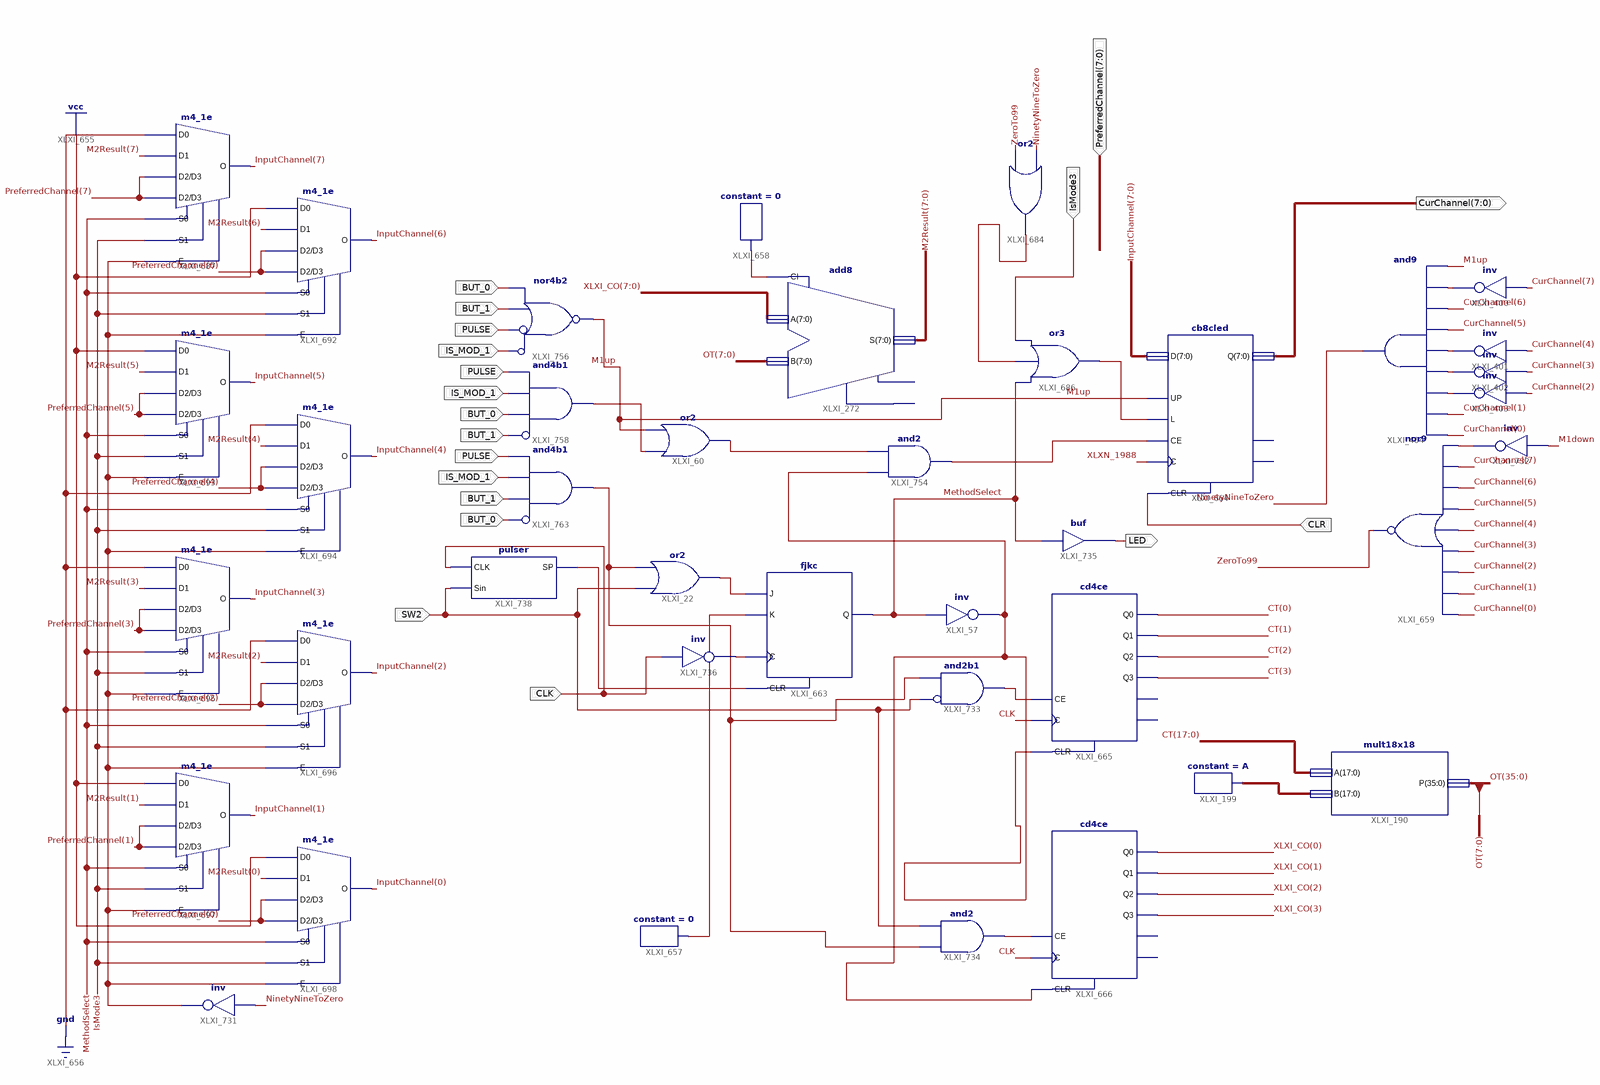
[diagram p0: schematic sheet 1]
// Xilinx ISE schematic mode1.sch (spartan3e) as structural Verilog: 39 symbols, 11 ports
module mode1 (
  input  IsMode3,
  input  CLR,
  input  CLK,
  input  SW2,
  input  BUT_0,
  input  BUT_1,
  input  [7:0] PreferredChannel,
  input  PULSE,
  input  IS_MOD_1,
  output [7:0] CurChannel,
  output LED
);

  wire M1down, M1up, MethodSelect, NinetyNineToZero, XLXN_160, XLXN_169, XLXN_223, XLXN_945, XLXN_1125,
       XLXN_1128, XLXN_1129, XLXN_1130, XLXN_1232, XLXN_1242, XLXN_1730, XLXN_1780, XLXN_1820, XLXN_1826,
       XLXN_1976, XLXN_1978, XLXN_1980, XLXN_1988, XLXN_1991, ZeroTo99;
  wire [7:0] InputChannel, M2Result, XLXI_CO;
  wire [17:0] CT, Ten;
  wire [35:0] OT;

  or XLXI_22 (XLXN_1826, SW2, XLXN_1232);
  or XLXI_60 (XLXN_223, M1down, M1up);
  not XLXI_57 (XLXN_1242, MethodSelect);
  constant #(.CValue("A")) XLXI_199 (.O(Ten));
  mult18x18 XLXI_190 (.A(CT), .B(Ten), .P(OT));
  add8 XLXI_272 (.A(XLXI_CO), .B(OT[7:0]), .CI(XLXN_1730), .S(M2Result));  // open: CO, OFL
  and XLXI_404 (NinetyNineToZero, M1up, XLXN_1125, CurChannel[6], CurChannel[5], XLXN_1128, XLXN_1129, XLXN_1130, CurChannel[1], CurChannel[0]);
  not XLXI_403 (XLXN_1130, CurChannel[2]);
  not XLXI_402 (XLXN_1129, CurChannel[3]);
  not XLXI_401 (XLXN_1128, CurChannel[4]);
  not XLXI_400 (XLXN_1125, CurChannel[7]);
  constant #(.CValue("0")) XLXI_657 (.O(XLXN_1820));
  constant #(.CValue("0")) XLXI_658 (.O(XLXN_1730));
  nor XLXI_659 (ZeroTo99, XLXN_1980, CurChannel[7], CurChannel[6], CurChannel[5], CurChannel[4], CurChannel[3], CurChannel[2], CurChannel[1], CurChannel[0]);
  fjkc XLXI_663 (.C(XLXN_1988), .CLR(XLXN_1991), .J(XLXN_1826), .K(XLXN_1820), .Q(MethodSelect));
  cb8cled XLXI_664 (
    .C(XLXN_1988), .CE(XLXN_945), .CLR(CLR), .D(InputChannel), .L(XLXN_1780), .UP(M1up), .Q(CurChannel));  // open: CEO, TC
  cd4ce XLXI_665 (
    .C(CLK), .CE(XLXN_169), .CLR(XLXN_1242), .Q0(CT[0]), .Q1(CT[1]), .Q2(CT[2]), .Q3(CT[3]));  // open: CEO, TC
  cd4ce XLXI_666 (
    .C(CLK), .CE(XLXN_160), .CLR(XLXN_1242), .Q0(XLXI_CO[0]), .Q1(XLXI_CO[1]), .Q2(XLXI_CO[2]),
    .Q3(XLXI_CO[3]));  // open: CEO, TC
  or XLXI_684 (XLXN_1978, ZeroTo99, NinetyNineToZero);
  or XLXI_686 (XLXN_1780, MethodSelect, XLXN_1978, IsMode3);
  m4_1e XLXI_698 (
    .D0(1'b1), .D1(M2Result[0]), .D2(PreferredChannel[0]), .D3(PreferredChannel[0]), .E(XLXN_1976),
    .S0(MethodSelect), .S1(IsMode3), .O(InputChannel[0]));
  m4_1e XLXI_697 (
    .D0(1'b1), .D1(M2Result[1]), .D2(PreferredChannel[1]), .D3(PreferredChannel[1]), .E(XLXN_1976),
    .S0(MethodSelect), .S1(IsMode3), .O(InputChannel[1]));
  m4_1e XLXI_696 (
    .D0(1'b0), .D1(M2Result[2]), .D2(PreferredChannel[2]), .D3(PreferredChannel[2]), .E(XLXN_1976),
    .S0(MethodSelect), .S1(IsMode3), .O(InputChannel[2]));
  m4_1e XLXI_695 (
    .D0(1'b0), .D1(M2Result[3]), .D2(PreferredChannel[3]), .D3(PreferredChannel[3]), .E(XLXN_1976),
    .S0(MethodSelect), .S1(IsMode3), .O(InputChannel[3]));
  m4_1e XLXI_694 (
    .D0(1'b0), .D1(M2Result[4]), .D2(PreferredChannel[4]), .D3(PreferredChannel[4]), .E(XLXN_1976),
    .S0(MethodSelect), .S1(IsMode3), .O(InputChannel[4]));
  m4_1e XLXI_693 (
    .D0(1'b1), .D1(M2Result[5]), .D2(PreferredChannel[5]), .D3(PreferredChannel[5]), .E(XLXN_1976),
    .S0(MethodSelect), .S1(IsMode3), .O(InputChannel[5]));
  m4_1e XLXI_692 (
    .D0(1'b1), .D1(M2Result[6]), .D2(PreferredChannel[6]), .D3(PreferredChannel[6]), .E(XLXN_1976),
    .S0(MethodSelect), .S1(IsMode3), .O(InputChannel[6]));
  not XLXI_731 (XLXN_1976, NinetyNineToZero);
  not XLXI_732 (XLXN_1980, M1down);
  and XLXI_733 (XLXN_169, ~SW2, XLXN_1232);  // and2b1
  and XLXI_734 (XLXN_160, XLXN_1232, SW2);
  buf XLXI_735 (LED, MethodSelect);
  not XLXI_736 (XLXN_1988, CLK);
  m4_1e XLXI_687 (
    .D0(1'b0), .D1(M2Result[7]), .D2(PreferredChannel[7]), .D3(PreferredChannel[7]), .E(XLXN_1976),
    .S0(MethodSelect), .S1(IsMode3), .O(InputChannel[7]));
  and XLXI_754 (XLXN_945, XLXN_1242, XLXN_223);
  and XLXI_763 (XLXN_1232, ~BUT_0, BUT_1, IS_MOD_1, PULSE);  // and4b1
  nor XLXI_756 (M1up, ~IS_MOD_1, ~PULSE, BUT_1, BUT_0);  // nor4b2
  and XLXI_758 (M1down, ~BUT_1, BUT_0, IS_MOD_1, PULSE);  // and4b1
  pulser XLXI_738 (.CLK(CLK), .Sin(SW2), .SP(XLXN_1991));
endmodule
